# Altium schematic sheet 4 Connectors.SchDoc
size C; DocumentNumber: 4; SheetNumber: 4; SheetTotal: 17
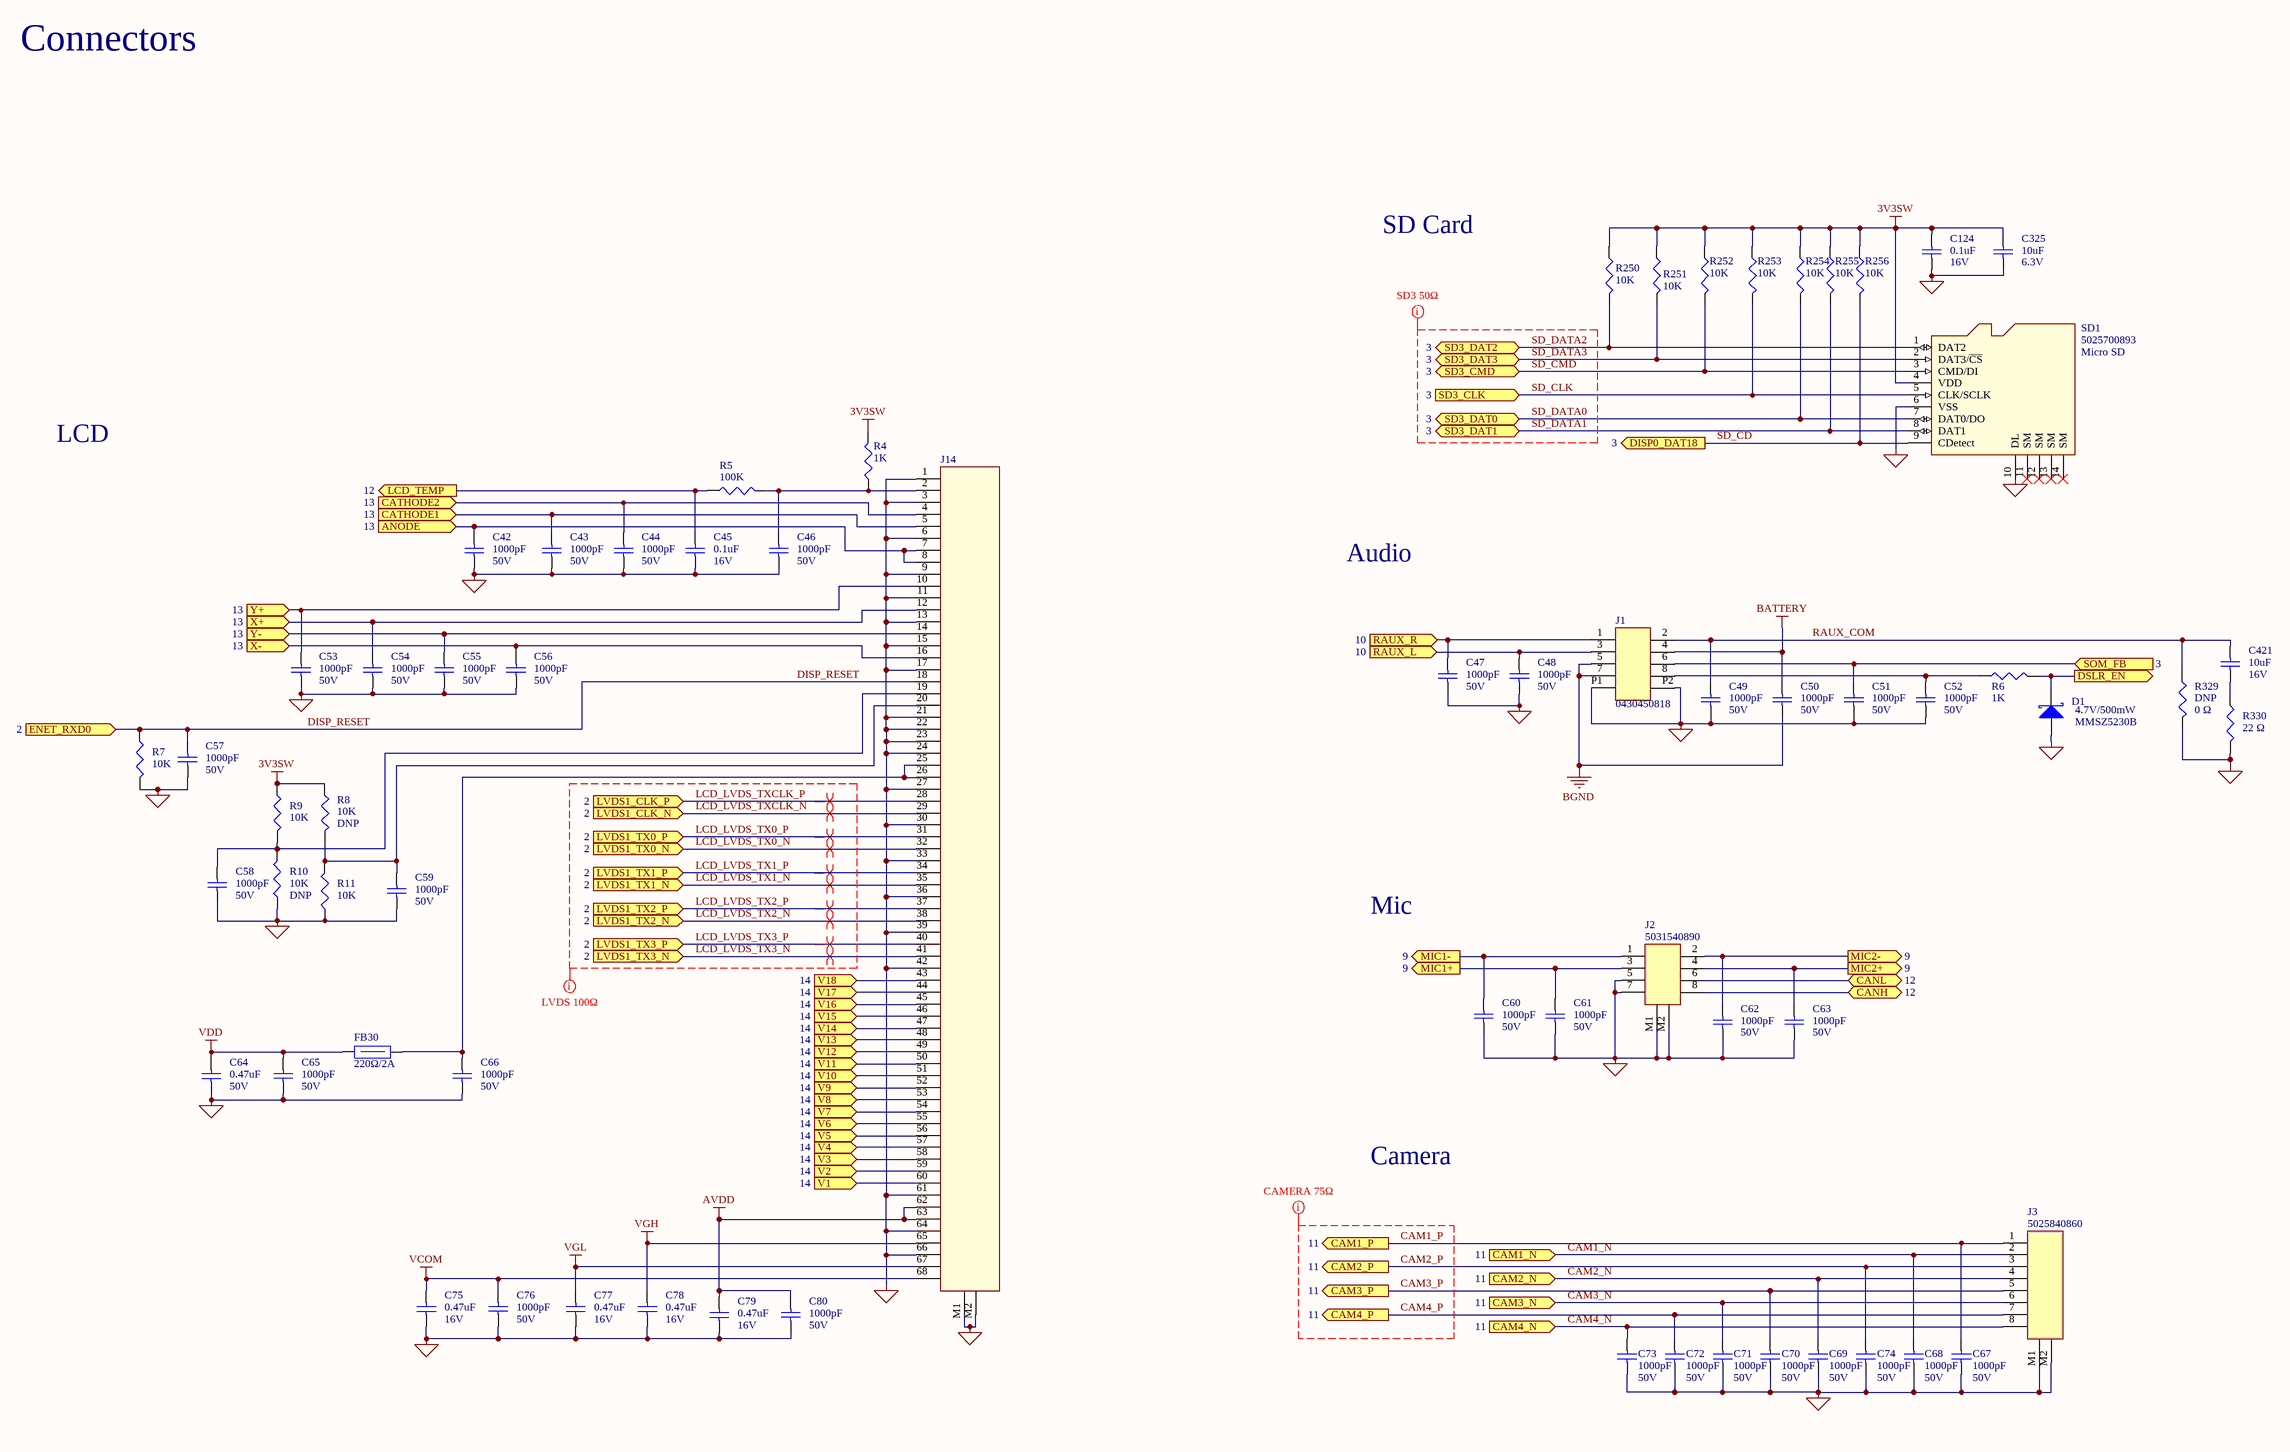
[diagram p0: 4 Connectors.SchDoc]

## Parts
C42  value 1000pF  Voltage: 50V  [CAP_0402]  (hidden comment: Cap 1000pF 50V 0402)
C43  value 1000pF  Voltage: 50V  [CAP_0402]  (hidden comment: Cap 1000pF 50V 0402)
C44  value 1000pF  Voltage: 50V  [CAP_0402]  (hidden comment: Cap 1000pF 50V 0402)
C45  value 0.1uF  Voltage: 16V  [CAP_0402]  (hidden comment: Cap 0.1uF 16V 0402)
C46  value 1000pF  Voltage: 50V  [CAP_0402]  (hidden comment: Cap 1000pF 50V 0402)
C47  value 1000pF  Voltage: 50V  [CAP_0402]  (hidden comment: Cap 1000pF 50V 0402)
C48  value 1000pF  Voltage: 50V  [CAP_0402]  (hidden comment: Cap 1000pF 50V 0402)
C49  value 1000pF  Voltage: 50V  [CAP_0402]  (hidden comment: Cap 1000pF 50V 0402)
C50  value 1000pF  Voltage: 50V  [CAP_0402]  (hidden comment: Cap 1000pF 50V 0402)
C51  value 1000pF  Voltage: 50V  [CAP_0402]  (hidden comment: Cap 1000pF 50V 0402)
C52  value 1000pF  Voltage: 50V  [CAP_0402]  (hidden comment: Cap 1000pF 50V 0402)
C53  value 1000pF  Voltage: 50V  [CAP_0402]  (hidden comment: Cap 1000pF 50V 0402)
C54  value 1000pF  Voltage: 50V  [CAP_0402]  (hidden comment: Cap 1000pF 50V 0402)
C55  value 1000pF  Voltage: 50V  [CAP_0402]  (hidden comment: Cap 1000pF 50V 0402)
C56  value 1000pF  Voltage: 50V  [CAP_0402]  (hidden comment: Cap 1000pF 50V 0402)
C57  value 1000pF  Voltage: 50V  [CAP_0402]  (hidden comment: Cap 1000pF 50V 0402)
C58  value 1000pF  Voltage: 50V  [CAP_0402]  (hidden comment: Cap 1000pF 50V 0402)
C59  value 1000pF  Voltage: 50V  [CAP_0402]  (hidden comment: Cap 1000pF 50V 0402)
C60  value 1000pF  Voltage: 50V  [CAP_0402]  (hidden comment: Cap 1000pF 50V 0402)
C61  value 1000pF  Voltage: 50V  [CAP_0402]  (hidden comment: Cap 1000pF 50V 0402)
C62  value 1000pF  Voltage: 50V  [CAP_0402]  (hidden comment: Cap 1000pF 50V 0402)
C63  value 1000pF  Voltage: 50V  [CAP_0402]  (hidden comment: Cap 1000pF 50V 0402)
C64  value 0.47uF  Voltage: 50V  [CAP_1206]  (hidden comment: Cap 0.47uF 50V 1206)
C65  value 1000pF  Voltage: 50V  [CAP_0402]  (hidden comment: Cap 1000pF 50V 0402)
C66  value 1000pF  Voltage: 50V  [CAP_0402]  (hidden comment: Cap 1000pF 50V 0402)
C67  value 1000pF  Voltage: 50V  [CAP_0402]  (hidden comment: Cap 1000pF 50V 0402)
C68  value 1000pF  Voltage: 50V  [CAP_0402]  (hidden comment: Cap 1000pF 50V 0402)
C69  value 1000pF  Voltage: 50V  [CAP_0402]  (hidden comment: Cap 1000pF 50V 0402)
C70  value 1000pF  Voltage: 50V  [CAP_0402]  (hidden comment: Cap 1000pF 50V 0402)
C71  value 1000pF  Voltage: 50V  [CAP_0402]  (hidden comment: Cap 1000pF 50V 0402)
C72  value 1000pF  Voltage: 50V  [CAP_0402]  (hidden comment: Cap 1000pF 50V 0402)
C73  value 1000pF  Voltage: 50V  [CAP_0402]  (hidden comment: Cap 1000pF 50V 0402)
C74  value 1000pF  Voltage: 50V  [CAP_0402]  (hidden comment: Cap 1000pF 50V 0402)
C75  value 0.47uF  Voltage: 16V  [CAP_0603]  (hidden comment: Cap 0.47uF 16V 0603)
C76  value 1000pF  Voltage: 50V  [CAP_0402]  (hidden comment: Cap 1000pF 50V 0402)
C77  value 0.47uF  Voltage: 16V  [CAP_0603]  (hidden comment: Cap 0.47uF 16V 0603)
C78  value 0.47uF  Voltage: 16V  [CAP_0603]  (hidden comment: Cap 0.47uF 16V 0603)
C79  value 0.47uF  Voltage: 16V  [CAP_0603]  (hidden comment: Cap 0.47uF 16V 0603)
C80  value 1000pF  Voltage: 50V  [CAP_0402]  (hidden comment: Cap 1000pF 50V 0402)
C124  value 0.1uF  Voltage: 16V  [CAP_0402]  (hidden comment: Cap 0.1uF 16V 0402)
C325  value 10uF  Voltage: 6.3V  [CAP_0402]  (hidden comment: Cap 10uF 6.3V 0402)
C421  value 10uF  Voltage: 16V  [CAP_0603]  (hidden comment: Cap 10uF 16V 0603)
D1  MMSZ5230B  value 4.7V/500mW  [SOD-123_MMSZ5230B]
FB30  value 220Ω/2A  [IND_0805]  (hidden comment: BKP2125HS221-T)
J1  0430450818  [CON_0430450818]
J2  5031540890  [CON_5031540890]
J3  5025840860  [CON_5025840860]
J14  FH28E-68S-0.5SH(05)  [CON_FH28E-68S-0.5SH(05)]  (value not drawn)
R4  value 1K  [RES_0402]  (hidden comment: Res 1K 0.063W)
R5  value 100K  [RES_0402]  (hidden comment: Res 100K 0.1W)
R6  value 1K  [RES_0402]  (hidden comment: Res 1K 0.063W)
R7  value 10K  [RES_0402]  (hidden comment: Res 10K 0.063W)
R8  value 10K  [RES_0402]  (hidden comment: Res 10K 0.063W)
R9  value 10K  [RES_0402]  (hidden comment: Res 10K 0.063W)
R10  value 10K  [RES_0402]  (hidden comment: Res 10K 0.063W)
R11  value 10K  [RES_0402]  (hidden comment: Res 10K 0.063W)
R250  value 10K  [RES_0402]  (hidden comment: Res 10K 0.063W)
R251  value 10K  [RES_0402]  (hidden comment: Res 10K 0.063W)
R252  value 10K  [RES_0402]  (hidden comment: Res 10K 0.063W)
R253  value 10K  [RES_0402]  (hidden comment: Res 10K 0.063W)
R254  value 10K  [RES_0402]  (hidden comment: Res 10K 0.063W)
R255  value 10K  [RES_0402]  (hidden comment: Res 10K 0.063W)
R256  value 10K  [RES_0402]  (hidden comment: Res 10K 0.063W)
R329  value 0 Ω  [RES_0402]  (hidden comment: Res 0 ohm 0.1W DNP)
R330  value 22 Ω  [RES_0402]  (hidden comment: Res 22R 0.063W)
SD1  5025700893  value Micro SD  [SD_502570-0893]

## Ports
ANODE (in, see 13), CAM1_N (in, see 11), CAM1_P (out, see 11), CAM2_N (in, see 11), CAM2_P (out, see 11), CAM3_N (in, see 11), CAM3_P (out, see 11), CAM4_N (in, see 11), CAM4_P (out, see 11), CANH (bidir, see 12), CANL (bidir, see 12), CATHODE1 (in, see 13), CATHODE2 (in, see 13), DISP0_DAT18 (out, see 3), DSLR_EN (out), ENET_RXD0 (in, see 2), LCD_TEMP (out, see 12), LVDS1_CLK_N (in, see 2), LVDS1_CLK_P (in, see 2), LVDS1_TX0_N (in, see 2), LVDS1_TX0_P (in, see 2), LVDS1_TX1_N (in, see 2), LVDS1_TX1_P (in, see 2), LVDS1_TX2_N (in, see 2), LVDS1_TX2_P (in, see 2), LVDS1_TX3_N (in, see 2), LVDS1_TX3_P (in, see 2), MIC1+ (out, see 9), MIC1- (out, see 9), MIC2+ (out, see 9), MIC2- (out, see 9), RAUX_L (in, see 10), RAUX_R (in, see 10), SD3_CLK (in, see 3), SD3_CMD (bidir, see 3), SD3_DAT0 (bidir, see 3), SD3_DAT1 (bidir, see 3), SD3_DAT2 (bidir, see 3), SD3_DAT3 (bidir, see 3), SOM_FB (in, see 3), V1 (in, see 14), V2 (in, see 14), V3 (in, see 14), V4 (in, see 14), V5 (in, see 14), V6 (in, see 14), V7 (in, see 14), V8 (in, see 14), V9 (in, see 14), V10 (in, see 14), V11 (in, see 14), V12 (in, see 14), V13 (in, see 14), V14 (in, see 14), V15 (in, see 14), V16 (in, see 14), V17 (in, see 14), V18 (in, see 14), X+ (in, see 13), X- (in, see 13), Y+ (in, see 13), Y- (in, see 13)

## Nets
3V3SW: C124.1 C325.1 R4.2 R8.1 R9.1 R250.1 R251.1 R252.1 R253.1 R254.1 R255.1 R256.1 SD1.4(VDD)
AVDD: C79.1 C80.1 J14.62 J14.63
BATTERY: C50.1 J1.4
BGND: C50.2 J1.5 J1.7
GND: C42.2 C43.2 C44.2 C45.2 C46.2 C47.2 C48.2 C49.2 C51.2 C52.2 C53.2 C54.2 C55.2 C56.2 C57.2 C58.2 C59.2 C60.2 C61.2 C62.2 C63.2 C64.2 C65.2 C66.2 C67.2 C68.2 C69.2 C70.2 C71.2 C72.2 C73.2 C74.2 C75.2 C76.2 C77.2 C78.2 C79.2 C80.2 C124.2 C325.2 D1.A J1.P1 J1.P2 J2.5 J2.7 J2.M1 J2.M2 J3.M1 J3.M2 J14.1 J14.3 J14.6 J14.9 J14.11 J14.13 J14.15 J14.17 J14.21 J14.22 J14.23 J14.24 J14.27 J14.30 J14.33 J14.36 J14.39 J14.42 J14.61 J14.64 J14.66 J14.M1 J14.M2 R7.2 R10.1 R11.1 R329.2 R330.2 SD1.6(VSS) SD1.10(DL)
VCOM: C75.1 C76.1 J14.68
VDD: C64.1 C65.1 FB30.1
VGH: C78.1 J14.65
VGL: C77.1 J14.67
ANODE: C42.1 J14.7 J14.8 ; port ANODE
CAM1_N: C68.1 J3.2 ; port CAM1_N
CAM1_P: C67.1 J3.1 ; port CAM1_P
CAM2_N: C69.1 J3.4 ; port CAM2_N
CAM2_P: C74.1 J3.3 ; port CAM2_P
CAM3_N: C71.1 J3.6 ; port CAM3_N
CAM3_P: C70.1 J3.5 ; port CAM3_P
CAM4_N: C73.1 J3.8 ; port CAM4_N
CAM4_P: C72.1 J3.7 ; port CAM4_P
CANH: J2.8 ; port CANH
CANL: J2.6 ; port CANL
CATHODE1: C43.1 J14.5 ; port CATHODE1
CATHODE2: C44.1 J14.4 ; port CATHODE2
DISP_RESET: C57.1 J14.18 R7.1 ; port ENET_RXD0
DSLR_EN: D1.K R6.2 ; port DSLR_EN
LCD_LVDS_TX0_N: J14.32 ; port LVDS1_TX0_N
LCD_LVDS_TX0_P: J14.31 ; port LVDS1_TX0_P
LCD_LVDS_TX1_N: J14.35 ; port LVDS1_TX1_N
LCD_LVDS_TX1_P: J14.34 ; port LVDS1_TX1_P
LCD_LVDS_TX2_N: J14.38 ; port LVDS1_TX2_N
LCD_LVDS_TX2_P: J14.37 ; port LVDS1_TX2_P
LCD_LVDS_TX3_N: J14.41 ; port LVDS1_TX3_N
LCD_LVDS_TX3_P: J14.40 ; port LVDS1_TX3_P
LCD_LVDS_TXCLK_N: J14.29 ; port LVDS1_CLK_N
LCD_LVDS_TXCLK_P: J14.28 ; port LVDS1_CLK_P
LCD_TEMP: C45.1 R5.1 ; port LCD_TEMP
MIC1+: C61.1 J2.3 ; port MIC1+
MIC1-: C60.1 J2.1 ; port MIC1-
MIC2+: C63.1 J2.4 ; port MIC2+
MIC2-: C62.1 J2.2 ; port MIC2-
RAUX_COM: C49.1 C421.1 J1.2 R329.1
RAUX_L: C48.1 J1.3 ; port RAUX_L
RAUX_R: C47.1 J1.1 ; port RAUX_R
SD_CD: R256.2 SD1.9(CDetect) ; port DISP0_DAT18
SD_CLK: R253.2 SD1.5(CLK/SCLK) ; port SD3_CLK
SD_CMD: R252.2 SD1.3(CMD/DI) ; port SD3_CMD
SD_DATA0: R254.2 SD1.7(DAT0/DO) ; port SD3_DAT0
SD_DATA1: R255.2 SD1.8(DAT1) ; port SD3_DAT1
SD_DATA2: R250.2 SD1.1(DAT2) ; port SD3_DAT2
SD_DATA3: R251.2 SD1.2(DAT3/~{CS}) ; port SD3_DAT3
SOM_FB: C51.1 J1.6 ; port SOM_FB
V1: J14.60 ; port V1
V2: J14.59 ; port V2
V3: J14.58 ; port V3
V4: J14.57 ; port V4
V5: J14.56 ; port V5
V6: J14.55 ; port V6
V7: J14.54 ; port V7
V8: J14.53 ; port V8
V9: J14.52 ; port V9
V10: J14.51 ; port V10
V11: J14.50 ; port V11
V12: J14.49 ; port V12
V13: J14.48 ; port V13
V14: J14.47 ; port V14
V15: J14.46 ; port V15
V16: J14.45 ; port V16
V17: J14.44 ; port V17
V18: J14.43 ; port V18
X+: C54.1 J14.12 ; port X+
X-: C56.1 J14.16 ; port X-
Y+: C53.1 J14.10 ; port Y+
Y-: C55.1 J14.14 ; port Y-
NetC46_1: C46.1 J14.2 R4.1 R5.2
NetC52_1: C52.1 J1.8 R6.1
NetC58_1: C58.1 J14.19 R9.2 R10.2
NetC59_1: C59.1 J14.20 R8.2 R11.2
NetC66_1: C66.1 FB30.2 J14.25 J14.26
NetC421_2: C421.2 R330.1

Not connected (* = marked no-connect by the designer): SD1 11(SM)* 12(SM)* 13(SM)* 14(SM)*

## Layout directives
net class SD3 50ohm: SD_CLK, SD_CMD, SD_DATA0, SD_DATA1, SD_DATA2, SD_DATA3
net class CAMERA 75ohm: CAM1_P, CAM2_P, CAM3_P, CAM4_P
differential pair: LCD_LVDS_TX0_N, LCD_LVDS_TX0_P, LCD_LVDS_TX1_N, LCD_LVDS_TX1_P, LCD_LVDS_TX2_N, LCD_LVDS_TX2_P, LCD_LVDS_TX3_N, LCD_LVDS_TX3_P, LCD_LVDS_TXCLK_N, LCD_LVDS_TXCLK_P
net class LVDS 100ohm: LCD_LVDS_TX0_N, LCD_LVDS_TX0_P, LCD_LVDS_TX1_N, LCD_LVDS_TX1_P, LCD_LVDS_TX2_N, LCD_LVDS_TX2_P, LCD_LVDS_TX3_N, LCD_LVDS_TX3_P, LCD_LVDS_TXCLK_N, LCD_LVDS_TXCLK_P

## Notes on the sheet
- Connectors
- SD Card
- LCD
- Audio
- Mic
- Camera
- First View Consultants
- Austin, Tx
- 512.582.9102
- firstviewconsultants.com
- Title:
- File:
- Drawn:
- Sheet
- of
- FVC #:
- Checked:
- Approved:
- Date:
- Page Size:
- C
- Rev.
- Time:

## Library data of the parts
C42-C44 C46-C63 C65-C74 C76 C80 = Cap 1000pF 50V 0402: Cap, Cer, 1000pF, 50V, 20%, X7R, 0402; Manufacturer: Murata Electronics North America; Manufacturer #: GRM155R71H102KA01D; Have Footprint: yes; Tolerance: 20%; PACKAGE: 0402
C45 C124 = Cap 0.1uF 16V 0402: Cap, Cer, 0.1uF, 16V, 10%, X7R, 0402; Manufacturer #: GRM155R71C104KA88D; Manufacturer: Murata Electronics North America; Have Footprint: yes; Package: 0402; Tolerance: ±10%
C64 = Cap 0.47uF 50V 1206: Cap, Cer, 0.47uF, 50V, 10%, X7R, 1206; Manufacturer: Yageo; Manufacturer #: CC1206KKX7R9BB474; Have Footprint: yes; Package: 1206; Tolerance: 10%
C75 C77-C79 = Cap 0.47uF 16V 0603: Cap, Cer, 0.47uF, 16V, 10%, X8R, 0603; Manufacturer: TDK Corporation; Manufacturer #: CGA3E3X8R1C474K080AD; Have Footprint: yes; Package: 0603; Tolerance: 10%
C325 = Cap 10uF 6.3V 0402: Cap, Cer, 10uF, 6.3V, 20%, X5R, 0402; Manufacturer #: CL05A106MQ5NUNC; Manufacturer: Samsung Electro-Mechanics America, Inc; Have Footprint: yes; RoHS: yes; Tolerance: ±20%; Operating Temperature: -55°C ~ 85°C; Package: 0402
C421 = Cap 10uF 16V 0603: Cap, Cer, 10uF, 16V, 20%, X5R, 0603; Manufacturer #: GRM188C81C106MA73D; Manufacturer: Murata Electronics North America; Have Footprint: yes; RoHS: yes; Tolerance: ±20%; Operating Temperature: -55°C ~ 85°C; Package: 0603
D1 = MMSZ5230B: Diode, Zener, 4.7V, 500mW, SOD-123; Manufacturer: Diodes Incorporated; Package: SOD-123; Manufacturer #: MMSZ5230B
FB30 = BKP2125HS221-T: Ind, Ferrite Bead, 220R, 50mOhm, 2A, 0805; Manufacturer: Taiyo Yuden; Manufacturer #: BKP2125HS221-T; Package: 0805
J1 = 0430450818: Conn, Header, 8 pos, 3mm pitch, SMD; Manufacturer: Molex Inc; Manufacturer #: 0430450818
J2 = 5031540890: Conn, Receptacle, 8 pos, 1.5mm pitch, SMD; Manufacturer: Molex Inc; Have Footprint: yes; Manufacturer #: 5031540890
J3 = 5025840860: Conn, Receptacle, 8 pos, 1.5mm pitch, SMD; Manufacturer: Molex Inc; Have Footprint: yes; Manufacturer #: 5025840860
J14 = FH28E-68S-0.5SH(05): Conn, FPC/FFC, 68Pos, .5MM, Horz., SMD; Manufacturer: Hirose Electric Co Ltd; Have Footprint: yes; RoHS: yes; Operating Temperature: -55°C ~ 85°C; Manufacturer #: FH28E-68S-0.5SH(05)
R4 R6 = Res 1K 0.063W: Res, 1K, 0.063W, 1%, 0402; Manufacturer #: CRCW04021K00FKED; Manufacturer: Vishay Dale; Have Footprint: yes; Package: 0402; Tolerance: ±1%
R5 = Res 100K 0.1W: Res, 100K, 0.1W, 1%, 0402; Manufacturer #: ERJ-2RKF1003X; Manufacturer: Panasonic Electronic Components; Have Footprint: yes; Package: 0402
R7-R11 R250-R256 = Res 10K 0.063W: Res, 10K, 1/16W, 1%, 0402; Manufacturer #: RC0402FR-0710KL; Manufacturer: Yageo; Have Footprint: yes; Package: 0402
  R8 R10: DNP: DNP
R329 = Res 0 ohm 0.1W DNP: Res, 0 ohm, 1/16W, 0402; Manufacturer #: CRCW04020000Z0ED; Manufacturer: Vishay Dale; Have Footprint: yes; Package: 0402; DNP: DNP
R330 = Res 22R 0.063W: Res, 22R, 0.063W, 1%, 0402; Manufacturer #: RC0402FR-0722RL; Manufacturer: Yageo; Have Footprint: yes; Tolerance: ±1%; RoHS: yes; Cost: *; Package: 0402
SD1 = 5025700893: Conn, Mico SD, RT, SMD; Manufacturer: Molex Inc; Have Footprint: yes; Manufacturer #: 5025700893